# Altium project EP4_ECD_On_Board_Comptuer.PrjPcb (part 2 of 2)

## Sheet IR.SchDoc
size Letter; SheetNumber: 10; SheetTotal: 11
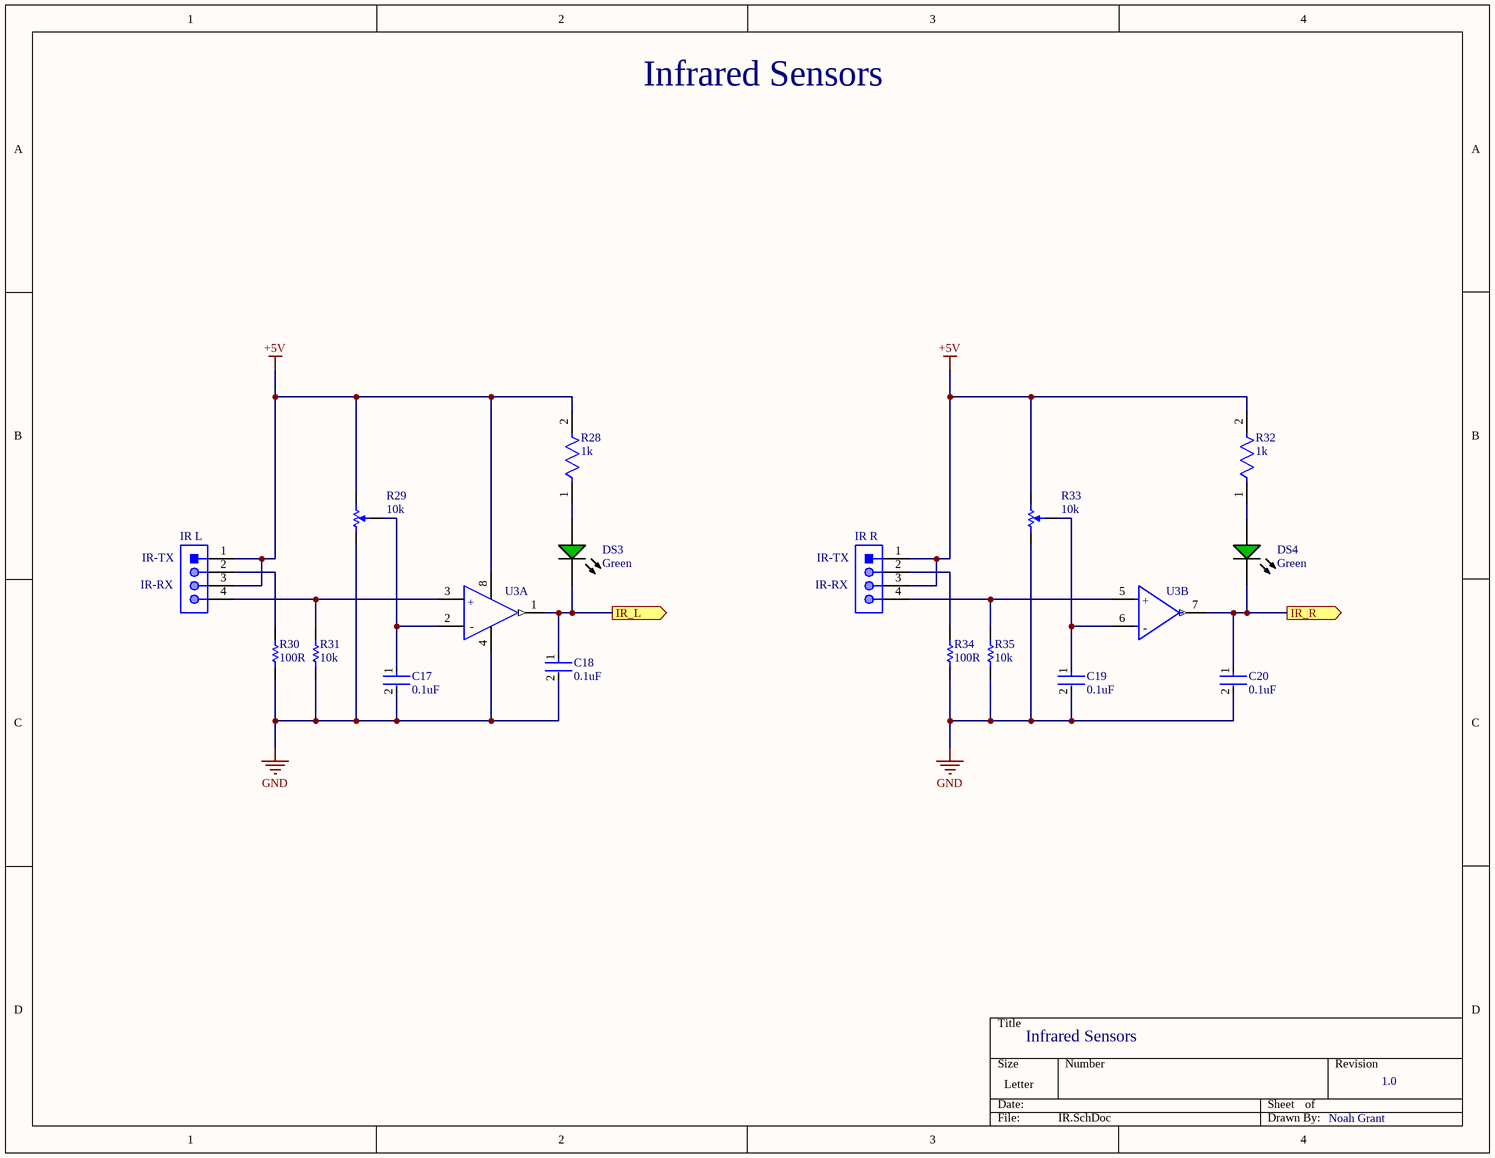
[diagram p6: IR.SchDoc]

### Parts
C17  0.1uF  [FP-CGA3E-0_3-0_1-IPC_A]
C18  0.1uF  [FP-CGA3E-0_3-0_1-IPC_A]
C19  0.1uF  [FP-CGA3E-0_3-0_1-IPC_A]
C20  0.1uF  [FP-CGA3E-0_3-0_1-IPC_A]
DS3  Green  [AVAG-HSMX-C190_V]
DS4  Green  [AVAG-HSMX-C190_V]
IR_L  61300411021  [61300411021]  (value not drawn)
IR_R  61300411021  [61300411021]  (value not drawn)
R28  1k  [FP-CRCW0603-e3-MFG]
R29  10k  [BOUR-TC33X-2_V]
R30  100R  [RESC1609X50X30ML8T20]
R31  10k  [RESC1609X50X30NL8T20]
R32  1k  [FP-CRCW0603-e3-MFG]
R33  10k  [BOUR-TC33X-2_V]
R34  100R  [RESC1609X50X30ML8T20]
R35  10k  [RESC1609X50X30NL8T20]
U3  LM393D  [FP-SO8-MFG]  (value not drawn)  (parts A,B of 2)

### Ports
IR_L (out, see Top_Sheet[4A], Nucleo[2B]), IR_R (out, see Top_Sheet[4A], Nucleo[1C])

### Nets
+5V: IR_L.1 IR_L.3 IR_R.1 IR_R.3 R28.2 R29.3 R32.2 R33.3 U3.8(Vcc+)
GND: C17.2 C18.2 C19.2 C20.2 R29.1 R30.1 R31.1 R33.1 R34.1 R35.1 U3.4(Vcc-)
IR_L: C18.1 DS3.2(K) U3.1(Out1) ; port IR_L
IR_R: C20.1 DS4.2(K) U3.7(Out2) ; port IR_R
NetC17_1: C17.1 R29.2 U3.2(In1-)
NetC19_1: C19.1 R33.2 U3.6(In2-)
NetDS3_1: DS3.1(A) R28.1
NetDS4_1: DS4.1(A) R32.1
NetIR_L_2: IR_L.2 R30.2
NetIR_L_4: IR_L.4 R31.2 U3.3(In1+)
NetIR_R_2: IR_R.2 R34.2
NetIR_R_4: IR_R.4 R35.2 U3.5(In2+)

### Notes on the sheet
- Infrared Sensors
- (near IR_L) IR-TX
- (near IR_R) IR-TX
- (near IR_L) IR-RX
- (near IR_R) IR-RX
- 1.0
- Noah Grant
- (in symbol CMP-12132-000003-1, part A) +; -
- (in symbol CMP-12132-000003-1, part B) +; -

### Library data of the parts
C17-C20 = CMP-2000-07546-2: Cap Ceramic 100nF 50V X7R 10% Pad SMD 0603 +125°C Automotive T/R; Weight: 7.1E-05oz; Composition: Ceramic; Max Operating Temperature: 125°C; Termination: SMD/SMT; Dielectric: X7R; Length: 1.6mm; Package Quantity: 1; REACH SVHC: No SVHC; Lead Free: Lead Free; Case Code (Metric): 1608; Min Operating Temperature: -55°C; Packaging: Tape and Reel; Tolerance: 10%; Voltage Rating: 50V; Case Code (Imperial): 0603; Capacitance: 100nF; Case/Package: 0603; Voltage Rating (DC): 50V; Depth: 0.8mm; Radiation Hardening: No; Ratings: AEC-Q200; Mount: Surface Mount; Voltage: 50V; Thickness: 0.035inch; Width: 0.8mm; Height: 0.8mm
DS3 DS4 = CMP-1744-00002-1: Chip LED, Green, 2.2 V, -40 to 85 degC, 2-Pin SMD, RoHS, Tape and Reel; Frequency: 400 KHz; Max Supply Voltage: 5.5 V; Access Time: 3500 ns; Clock Frequency: 100 KHz; Case\Package: SOIC; Density: 32 kb; Nominal Supply Current: 2 mA; Interface: Serial; Min Supply Voltage: 1.7 V; Packaging: Tape and Reel; PackageReference: HSMX-C190; ComponentLink2URL: http://docs.avagotech.com/docs/AV02-0551EN; RoHSCompliant: true; Pins: 8; REACH SVHC: No SVHC; Max Operating Temperature: 85 degC; Width: 4 mm; Radiation Hardening: No; Package Quantity: 3000; ComponentLink3Description: Package Specification; ComponentLink1Description: Manufacturer URL; Min Operating Temperature: -40 degC; PackageDescription: 2-Pin Surface Mount Device, Body 1.6 x 0.8 mm, Height 0.9 mm; Max Clock Frequency: 100 KHz; Height: 1.5 mm; ComponentLink1URL: http://www.avagotech.com/; DatasheetVersion: Mar-12; ComponentLink2Description: Datasheet; Mount: Surface Mount; Length: 5 mm; ComponentLink3URL: http://www.fairchildsemi.com/dwg/MA/MA03D.pdf
IR_L IR_R = CMP-1502-01063-1: THT Angled Pin Header WR-PHD, Pitch 2.54 mm, Single Row, 4 pins; Manufacturer: Wurth Elektronik; Gender: Male; Pin Number: 4; Withstanding Voltage: 500VAC; Working Voltage: 250VAC; Contact Resistance: 20mOhm; Pitch: 2.54mm; Rated Current: 3A; Manufacturer URL: http://www.we-online.de; Mounting Technology: THT; Publisher: WurthElektronik; Operating Temperature: -40to105degC; Packaging: Bag; Row Number: Single; Package Reference: 61300411021; Part Number: 61300411021; Orientation: Angled; Datasheet URL: https://katalog.we-online.de/em/datasheet/6130xx11021.pdf
R28 R32 = CMP-1666-00003-5: RES Thick Film, 1kΩ, 1%, 0.1W, 100ppm/°C, 0603; Max Power Dissipation: 100mW; Voltage Rating: 75V; Resistance: 1kR; Max Operating Temperature: 155°C; Number of Pins: 2; Case Code (Imperial): 0603; Width: 0.033inch; Power Rating: 100mW; Number of Terminations: 2; Package Quantity: 10; Weight: 7.1E-05oz; Tolerance: 1%; Temperature Coefficient: 100ppm/°C; Military Standard: Not; Mount: Surface Mount; Voltage Rating (DC): 75V; Depth: 0.85mm; Composition: Thick Film; Radiation Hardening: No; Termination: SMD/SMT; Length: 1.55mm; Case Code (Metric): 1608; Contact Plating: Tin; Min Operating Temperature: -55°C; Packaging: Tape and Reel; Height: 0.45mm; Lead Free: Lead Free; Case/Package: 0603; Features: Automotive AEC-Q200
R29 R33 = CMP-2100-03695-1: Trimming Potentiometer, 10000 Ohm, -40 to 100 degC, 3-Pin SMD, RoHS, Tape and Reel; Manufacturer: Bourns; Tolerance: 25%; Max Power Dissipation: 100mW; Number of Turns: 1; Resistance: 10KOhm; Temperature Coefficient: 250ppm/degreesC; Voltage Rating (DC): 50V; Datasheet URL: http://www.bourns.com/docs/Product-Datasheets/TC33.pdf; Composition: Potentiometer; Package Description: 3-Pin Surface Mount Device, Body 3.8 x 3.6 mm; Weight: 29.4mg; Power Rating: 100mW; Termination: FootPrint; Manufacturer URL: http://www.bourns.com/; Width: 0.118inch; Height: 0.047inch; Military Standard: Not; Radiation Hardening: No; Colour: Silver; Case/Package: SMD/SMT; Depth: 3.8mm; Min Operating Temperature: -40degC; Lead Free: LeadFree; Datasheet Version: 42583.0; REACH SVHC: NoSVHC; Length: 3mm; RoHSCompliant: true; Contact Plating: Silver; Taper: Linear; Packaging: TapeandReel; Mount: SurfaceMount; Max Operating Temperature: 100degC; Package Reference: TC33X-2; Package Quantity: 2500
R30 R34 = CMP-2000-03824-5: Chip Resistor, 100 Ohm, +/- 1%, 100 mW,-55 to 155 degC, 0603 (1608 Metric), RoHS, Tape and Ree; Manufacturer: Vishay Semiconductor; ComponentLink2URL: http://www.vishay.com/docs/20035/dcrcwe3.pdf; ComponentLink1URL: http://www.vishay.com/; Mounting Technology: Surface Mount; ComponentLink1Description: Manufacturer URL; ComponentLink2Description: Datasheet; PackageDescription: 2-Pin Surface Mount Device, Body 1.575 x 0.85 mm; PackageReference: 0603; DatasheetVersion: 06/2012
R31 R35 = CMP-1666-00005-4: Chip Resistor, 10 KOhm, +/- 1%, 100 mW, -55 to 155 degC, 0603 (1608 Metric), RoHS, Tape and Reel; Manufacturer: Vishay Semiconductor; Voltage Rating: 75 V; Max Operating Temperature: 155 degC; PackageDescription: 2-Pin Surface Mount Device, Body 1.575 x 0.85 mm; ComponentLink1Description: Manufacturer URL; RoHSCompliant: true; PackageReference: 0603; REACH SVHC: Unknown; Length: 1.55 mm; DatasheetVersion: 06/2012; Packaging: Tape and Reel; Min Operating Temperature: -55 degC; Mounting Technology: Surface Mount; ComponentLink2URL: https://datasheet.ciiva.com/11809/0900766b80d98afc-11809037.pdf; Height: 0.45 mm; ComponentLink2Description: Datasheet; Package Quantity: 5000; ComponentLink1URL: http://www.vishay.com/
U3 = CMP-12132-000003-1: IC VOLT COMPARATOR DUAL LP 8SOIC; Manufacturer: STMicroelectronics; Response Time: 1.3us; Min Supply Voltage: 2V; Input Offset Voltage: 1mV; Input Bias Current: 0.02uA; Max Dual Supply Voltage: 18V; Output Current Per Channel: 18mA; Max Junction Temp: +150°C; Standoff Height: 0.1mm; Number Of Channels: 2; Nominal Supply Current: 0.45-0.6mA; Voltage Gain: 200V/mV; Max Supply Voltage: 36V; Min Dual Supply Voltage: 1V; Ambient Temperature Range Low: 0°C; ComponentLink2Description: Datasheet; Lead Free: Yes; Device Class L3: Comparators; Device Class L2: Linear ICs; Manufacturer Part Number: LM393D; Digikey Description: IC VOLT COMPARATOR DUAL LP 8SOIC; Category: IC; Octopart: https://octopart.com/lm393d-stmicroelectronics-25832; Package: SO8; RoHS: TRUE; Footprint Url: https://www.st.com/resource/en/datasheet/stm8l001j3.pdf; Temperature Range Low: 0°C; Temperature Range High: +70°C; Mouser Description: Analog Comparators Lo-Pwr Dual Voltage; ComponentLink2URL: https://www.st.com/resource/en/datasheet/lm393.pdf; Automotive: No; Temperature: 0°C to +70°C; Height: 1.75mm; Device Class L1: Integrated Circuits (ICs); Ambient Temperature Range High: +70°C

## Sheet LCD_ULTRA.SchDoc
size Letter; SheetNumber: 8; SheetTotal: 11
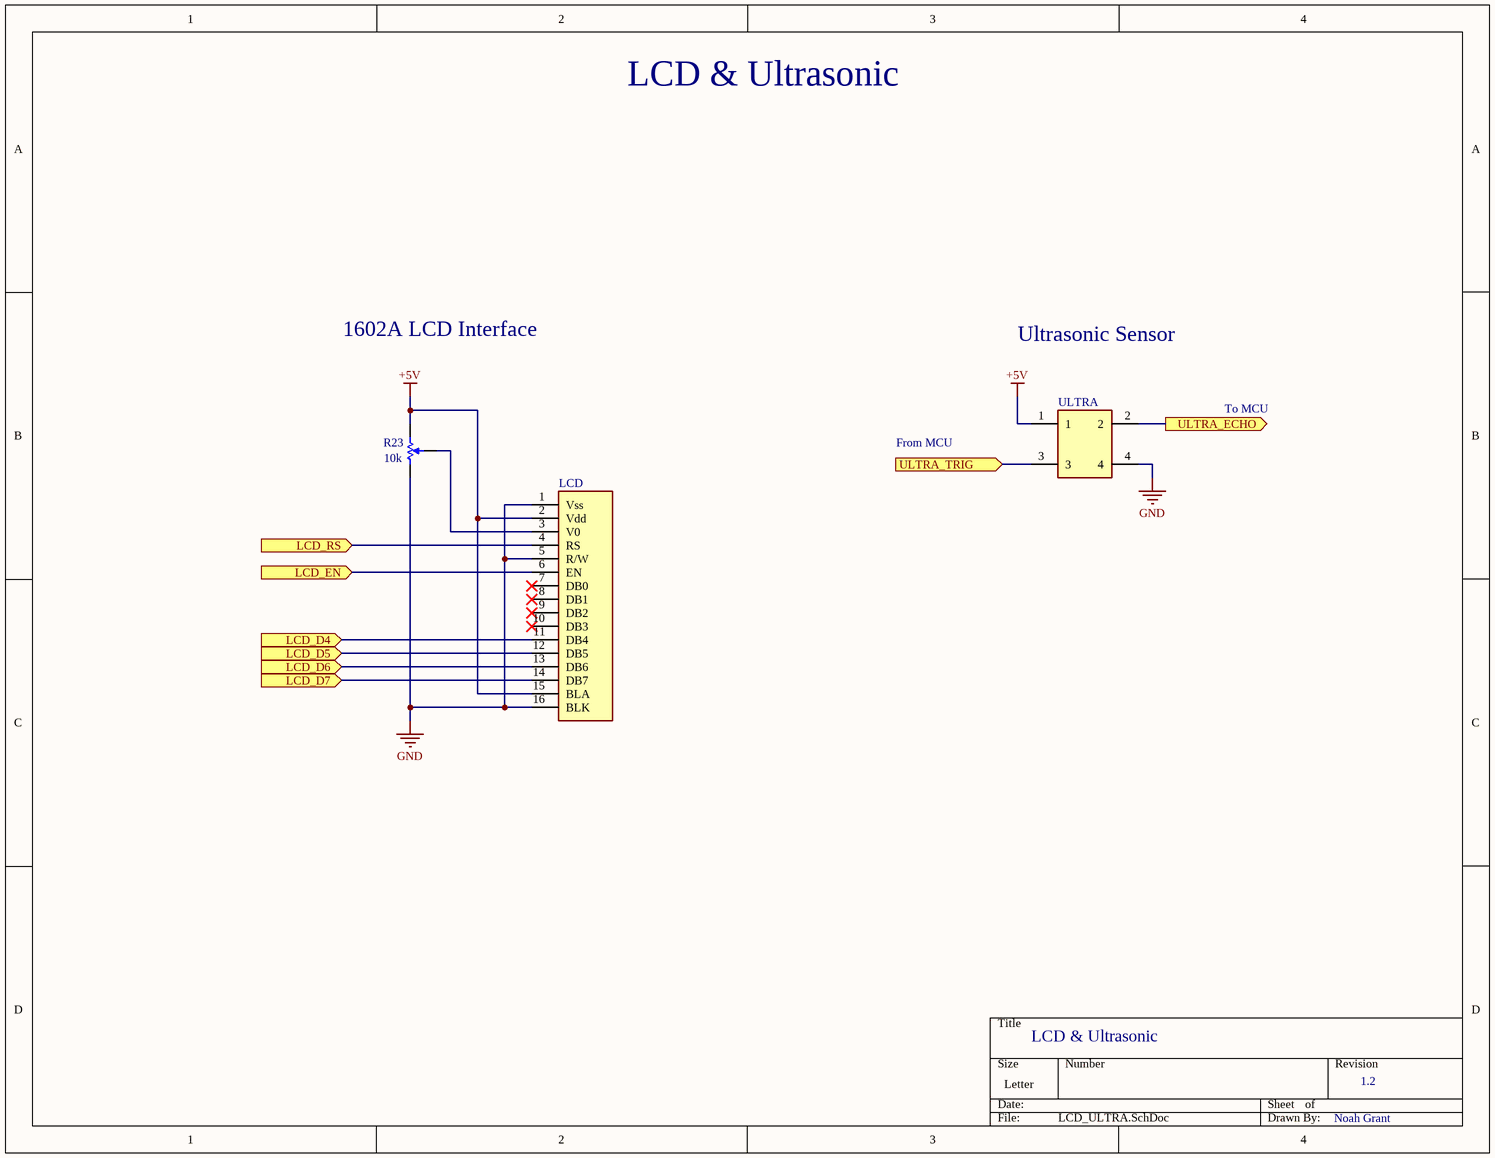
[diagram p7: LCD_ULTRA.SchDoc]

### Parts
LCD  PPPC161LFBN-RC  [RHDR16W80P0X254_1X16_4114X254X850P]  (value not drawn)
R23  10k  [BOUR-TC33X-2_V]
ULTRA  22-28-4043  [HDRV4W87P0X254_1X4_1016X249X863P]  (value not drawn)

### Ports
LCD_D4 (in, see Top_Sheet[4C], Nucleo[3C]), LCD_D5 (in, see Top_Sheet[4C], Nucleo[3C]), LCD_D6 (in, see Top_Sheet[4C], Nucleo[3C]), LCD_D7 (in, see Top_Sheet[4C], Nucleo[4C]), LCD_EN (in, see Top_Sheet[4C], Nucleo[3C]), LCD_RS (in, see Top_Sheet[4C], Nucleo[3C]), ULTRA_ECHO (out, see Top_Sheet[4C], Nucleo[3C]), ULTRA_TRIG (in, see Top_Sheet[4C], Nucleo[4C])

### Nets
+5V: LCD.2(Vdd) LCD.15(BLA) R23.3 ULTRA.1
GND: LCD.1(Vss) LCD.5(R/W) LCD.16(BLK) R23.1 ULTRA.4
LCD_D4: LCD.11(DB4) ; port LCD_D4
LCD_D5: LCD.12(DB5) ; port LCD_D5
LCD_D6: LCD.13(DB6) ; port LCD_D6
LCD_D7: LCD.14(DB7) ; port LCD_D7
LCD_EN: LCD.6(EN) ; port LCD_EN
LCD_RS: LCD.4(RS) ; port LCD_RS
ULTRA_ECHO: ULTRA.2 ; port ULTRA_ECHO
ULTRA_TRIG: ULTRA.3 ; port ULTRA_TRIG
NetLCD_3: LCD.3(V0) R23.2

Not connected (* = marked no-connect by the designer): LCD 7(DB0)* 8(DB1)* 9(DB2)* 10(DB3)*

### Notes on the sheet
- LCD & Ultrasonic
- 1602A LCD Interface
- Ultrasonic Sensor
- To MCU
- From MCU
- 1.2
- Noah Grant

### Library data of the parts
LCD = PPPC161LFBN-RC: Connector; Manufacturer_Name: Sullins; Datasheet Link: https://drawings-pdf.s3.amazonaws.com/10492.pdf; Height: 8.5mm; Manufacturer_Part_Number: PPPC161LFBN-RC
R23 = CMP-2100-03695-1: as R29 on sheet IR; Datasheet URL: http://www.bourns.com/docs/Product-Datasheets/TC33.pdf; Composition: Potentiometer; Package Description: 3-Pin Surface Mount Device, Body 3.8 x 3.6 mm; Weight: 29.4mg; Power Rating: 100mW; Termination: FootPrint; Manufacturer URL: http://www.bourns.com/; Width: 0.118inch; Height: 0.047inch; Military Standard: Not; Radiation Hardening: No; Colour: Silver; Case/Package: SMD/SMT; Depth: 3.8mm; Min Operating Temperature: -40degC; Lead Free: LeadFree; Datasheet Version: 42583.0; REACH SVHC: NoSVHC; Length: 3mm; RoHSCompliant: true; Contact Plating: Silver; Taper: Linear; Packaging: TapeandReel; Mount: SurfaceMount; Max Operating Temperature: 100degC; Package Reference: TC33X-2; Package Quantity: 2500
ULTRA = 22-28-4043: Connector; Manufacturer_Name: Molex; Datasheet Link: http://www.molex.com/molex/products/datasheet.jsp?part=active/0022284023_PCB_HEADERS.xml; Height: 8.63mm; Manufacturer_Part_Number: 22-28-4043; Mouser Part Number: 538-22-28-4043; Mouser Price/Stock: https://www.mouser.co.uk/ProductDetail/Molex/22-28-4043?qs=MuwpYaHj751%252Bm8qLwZDsXA%3D%3D

## Sheet Debug.SchDoc
size Letter; SheetNumber: 11; SheetTotal: 11
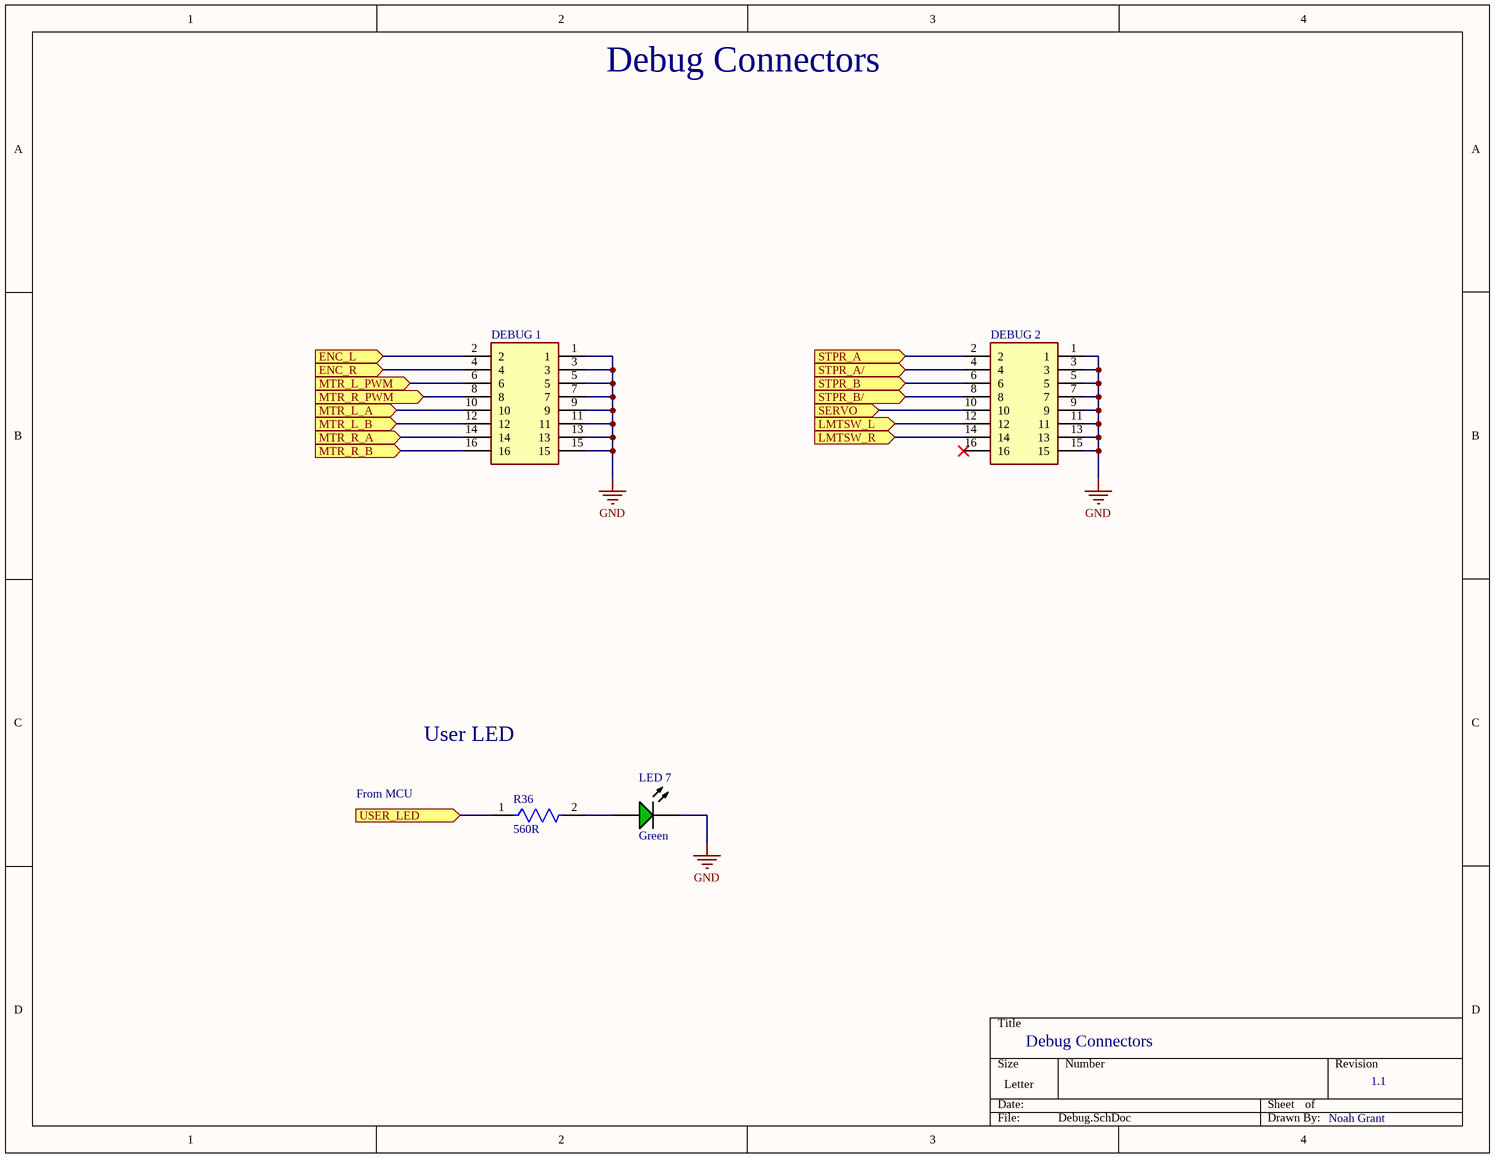
[diagram p8: Debug.SchDoc]

### Parts
DEBUG_1  3020-16-0300-00  [302016030000]  (value not drawn)
DEBUG_2  3020-16-0300-00  [302016030000]  (value not drawn)
LED_7  Green  [AVAG-HSMX-C190_V]
R36  560R  [FP-CPF0603-MFG]

### Ports
ENC_L (in, see Top_Sheet[2D], DCMTR_ENC[2B], Nucleo[2C]), ENC_R (in, see Top_Sheet[2D], DCMTR_ENC[1A], Nucleo[2C]), LMTSW_L (in, see Top_Sheet[2D], Nucleo[4B], STPR_LMTSW_SRV[2C]), LMTSW_R (in, see Top_Sheet[3D], Nucleo[4B], STPR_LMTSW_SRV[2D]), MTR_L_A (in, see Top_Sheet[2D], DCMTR_ENC[3C], Nucleo[1B]), MTR_L_B (in, see Top_Sheet[2D], DCMTR_ENC[3C], Nucleo[1C]), MTR_L_PWM (in, see Top_Sheet[2D], DCMTR_ENC[3C], Nucleo[1B]), MTR_R_A (in, see Top_Sheet[2D], DCMTR_ENC[3C], Nucleo[4B]), MTR_R_B (in, see Top_Sheet[2D], DCMTR_ENC[3C], Nucleo[3B]), MTR_R_PWM (in, see Top_Sheet[2D], DCMTR_ENC[3C], Nucleo[2B]), SERVO (in, see Top_Sheet[3D], Nucleo[4C], STPR_LMTSW_SRV[3C]), STPR_A (in, see Top_Sheet[3D], Nucleo[2C], STPR_LMTSW_SRV[1B]), STPR_A/ (in, see Top_Sheet[3D], Nucleo[2C], STPR_LMTSW_SRV[1B]), STPR_B (in, see Top_Sheet[3D], Nucleo[1C], STPR_LMTSW_SRV[1B]), STPR_B/ (in, see Top_Sheet[3D], Nucleo[1C], STPR_LMTSW_SRV[1B]), USER_LED (in, see Top_Sheet[3D], Nucleo[1C])

### Nets
GND: DEBUG_1.1 DEBUG_1.3 DEBUG_1.5 DEBUG_1.7 DEBUG_1.9 DEBUG_1.11 DEBUG_1.13 DEBUG_1.15 DEBUG_2.1 DEBUG_2.3 DEBUG_2.5 DEBUG_2.7 DEBUG_2.9 DEBUG_2.11 DEBUG_2.13 DEBUG_2.15 LED_7.2(K)
ENC_L: DEBUG_1.2 ; port ENC_L
ENC_R: DEBUG_1.4 ; port ENC_R
LMTSW_L: DEBUG_2.12 ; port LMTSW_L
LMTSW_R: DEBUG_2.14 ; port LMTSW_R
MTR_L_A: DEBUG_1.10 ; port MTR_L_A
MTR_L_B: DEBUG_1.12 ; port MTR_L_B
MTR_L_PWM: DEBUG_1.6 ; port MTR_L_PWM
MTR_R_A: DEBUG_1.14 ; port MTR_R_A
MTR_R_B: DEBUG_1.16 ; port MTR_R_B
MTR_R_PWM: DEBUG_1.8 ; port MTR_R_PWM
SERVO: DEBUG_2.10 ; port SERVO
STPR_A: DEBUG_2.2 ; port STPR_A
STPR_A/: DEBUG_2.4 ; port STPR_A/
STPR_B: DEBUG_2.6 ; port STPR_B
STPR_B/: DEBUG_2.8 ; port STPR_B/
USER_LED: R36.1 ; port USER_LED
NetLED_7_1: LED_7.1(A) R36.2

Not connected (* = marked no-connect by the designer): DEBUG_2 16*

### Notes on the sheet
- Debug Connectors
- User LED
- From MCU
- 1.1
- Noah Grant

### Library data of the parts
DEBUG_1 DEBUG_2 = 3020-16-0300-00: Connector; Manufacturer_Name: CNC Tech; Datasheet Link: http://cnctech.us/pdfs/3020-XX-0300-00.pdf; Height: 9.95mm; Manufacturer_Part_Number: 3020-16-0300-00; Arrow Part Number: 3020-16-0300-00; Arrow Price/Stock: https://www.arrow.com/en/products/3020-16-0300-00/cnc-tech-llc?region=nac
LED_7 = CMP-1744-00002-1: as DS3 on sheet IR; Packaging: Tape and Reel; PackageReference: HSMX-C190; ComponentLink2URL: http://docs.avagotech.com/docs/AV02-0551EN; RoHSCompliant: true; Pins: 8; REACH SVHC: No SVHC; Max Operating Temperature: 85 degC; Width: 4 mm; Radiation Hardening: No; Package Quantity: 3000; ComponentLink3Description: Package Specification; ComponentLink1Description: Manufacturer URL; Min Operating Temperature: -40 degC; PackageDescription: 2-Pin Surface Mount Device, Body 1.6 x 0.8 mm, Height 0.9 mm; Max Clock Frequency: 100 KHz; Height: 1.5 mm; ComponentLink1URL: http://www.avagotech.com/; DatasheetVersion: Mar-12; ComponentLink2Description: Datasheet; Mount: Surface Mount; Length: 5 mm; ComponentLink3URL: http://www.fairchildsemi.com/dwg/MA/MA03D.pdf
R36 = CMP-03211-007342-1: RES SMD 560Ω 0.1% 1/16W 0603; Manufacturer Part Number: CPF0603B560RE1; Manufacturer: TE Connectivity; Temperature Coefficient: 25ppm/°C; Voltage Rating: 50V; Power Rating: 0.063W; Lead Free: Yes; Automotive: No; Octopart: https://octopart.com/cpf0603b560re1-te+connectivity-9539416; Temperature Range High: +155°C; Device Class L2: Resistors; Temperature Range Low: -55°C; Composition: Thin Film; RoHS: TRUE; ComponentLink2URL: https://www.te.com/commerce/DocumentDelivery/DDEController?Action=showdoc&DocId=Data+Sheet%7F1773200%7FM%7Fpdf%7FEnglish%7FENG_DS_1773200_M.pdf%7F3-1676481-2; Temperature: -55°C to +155°C; Device Class L1: Passive Components; Resistance: 560Ω; Height: 0.55mm; Series: CPF; octopart_url: https://octopart.com/cpf0603b560re1-te+connectivity-9539416; Category: Res; Tolerance: 0.1%; ComponentLink2Description: Datasheet; packaging: 1k Reel; Package: CPF0603; Device Class L3: Chip SMD Resistors; Value: 560Ω; Ipc Land Pattern Name: RESC15580X45

## Sheet PC104_Connectors.SchDoc
size Letter; SheetNumber: 2; SheetTotal: 11
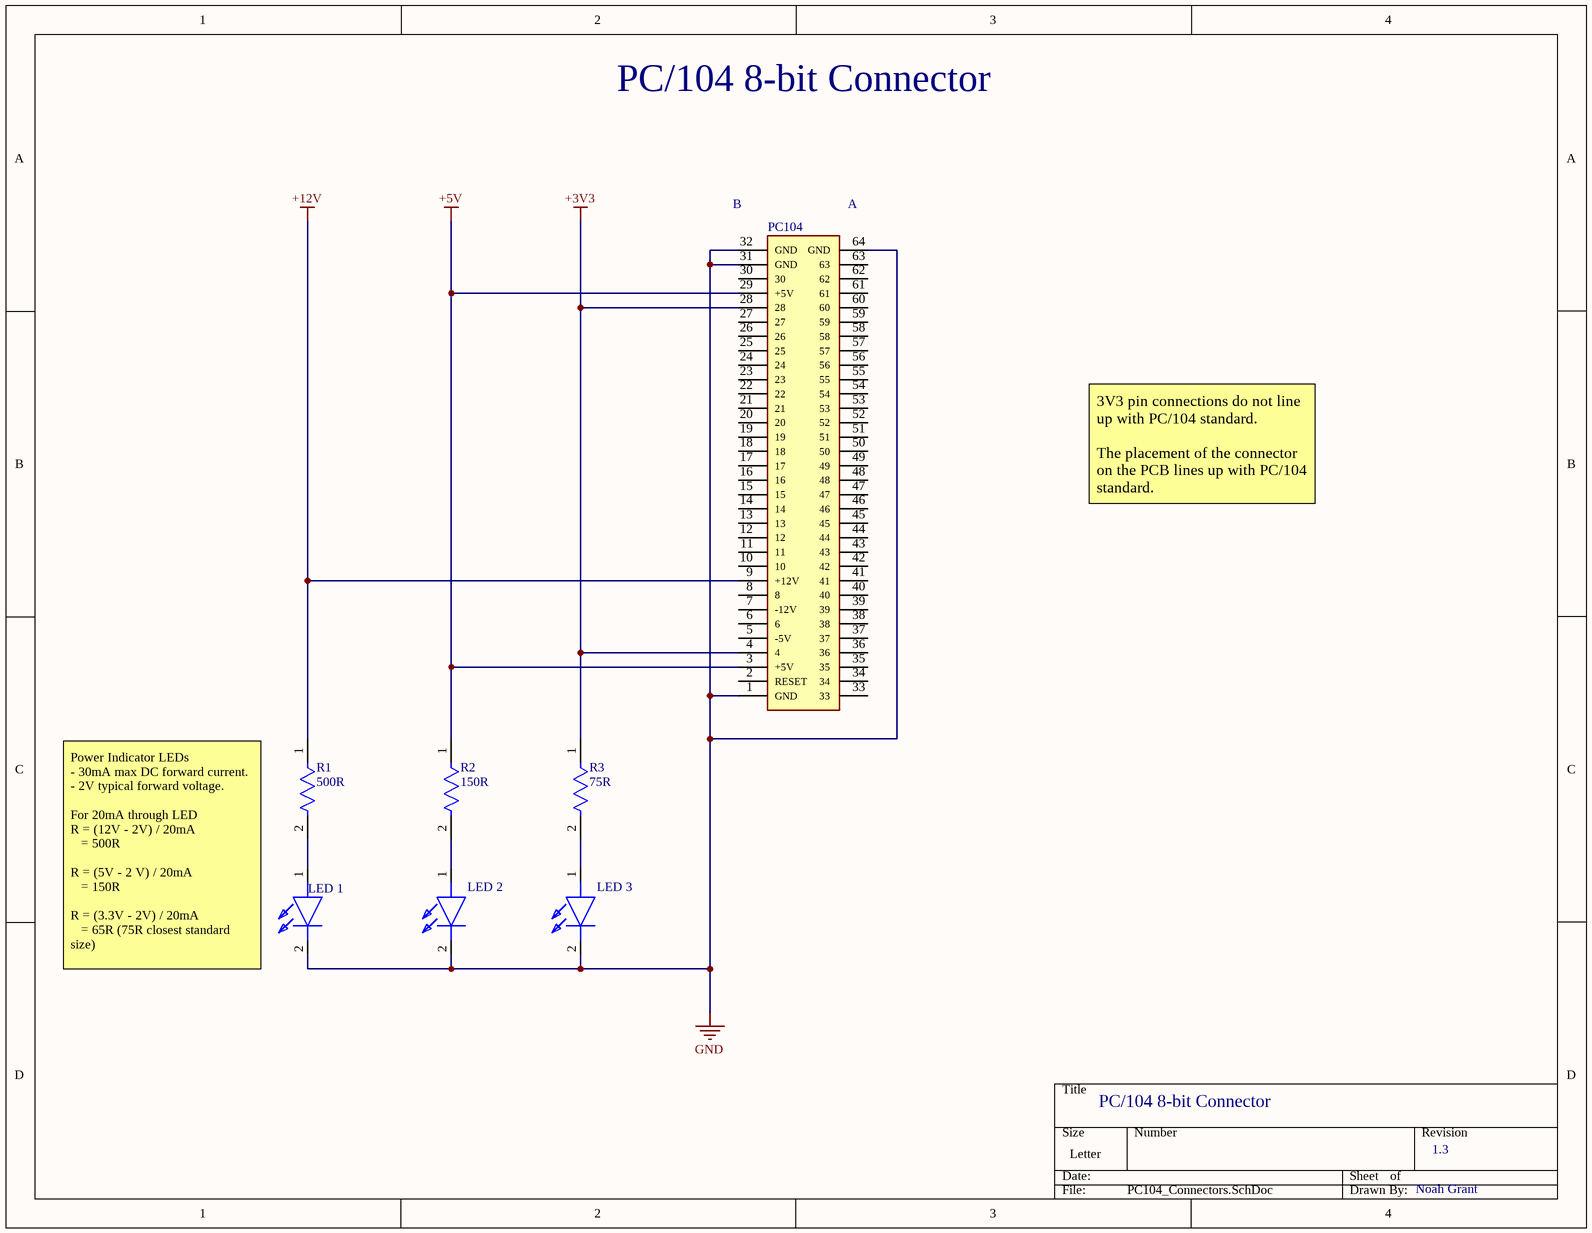
[diagram p9: PC104_Connectors.SchDoc]

### Parts
LED_1  APL3015EC-F01  [APL3015ECF01]  (value not drawn)
LED_2  APL3015EC-F01  [APL3015ECF01]  (value not drawn)
LED_3  APL3015EC-F01  [APL3015ECF01]  (value not drawn)
PC104  10153302-32111LF  [RHDR64W74P254_2X32_8238X499X1115P]  (value not drawn)
R1  500R  [FP-TFCR0603-IPC_A]
R2  150R  [FP-MCT0603-IPC_C]
R3  75R  [FP-RT0603-MFG]

### Nets
+3V3: PC104.4 PC104.28 R3.1
+5V: PC104.3(+5V) PC104.29(+5V) R2.1
+12V: PC104.9(+12V) R1.1
GND: LED_1.2(K) LED_2.2(K) LED_3.2(K) PC104.1(GND) PC104.31(GND) PC104.32(GND) PC104.64(GND)
NetLED_1_1: LED_1.1(A) R1.2
NetLED_2_1: LED_2.1(A) R2.2
NetLED_3_1: LED_3.1(A) R3.2

Not connected (* = marked no-connect by the designer): PC104 2(RESET) 5(-5V) 6 7(-12V) 8 10 11 12 13 14 15 16 17 18 19 20 21 22 23 24 25 26 27 30 33 34 35 36 37 38 39 40 41 42 43 44 45 46 47 48 49 50 51 52 53 54 55 56 57 58 59 60 61 62 63

### Notes on the sheet
- PC/104 8-bit Connector
- (near PC104) B
- (near PC104) A
- 3V3 pin connections do not line up with PC/104 standard.
  The placement of the connector on the PCB lines up with PC/104 standard.
- Power Indicator LEDs
  - 30mA max DC forward current.
  - 2V typical forward voltage.
  For 20mA through LED
  R = (12V - 2V) / 20mA
  = 500R
  R = (5V - 2 V) / 20mA
  = 150R
  R = (3.3V - 2V) / 20mA
  = 65R (75R closest standard size)
- 1.3
- Noah Grant

### Library data of the parts
LED_1-LED_3 = APL3015EC-F01: LED; Manufacturer_Name: Kingbright; Datasheet Link: https://componentsearchengine.com/Datasheets/1/APL3015EC-F01.pdf; Manufacturer_Part_Number: APL3015EC-F01; Mouser Part Number: 604-APL3015EC-F01; Mouser Price/Stock: https://www.mouser.co.uk/ProductDetail/Kingbright/APL3015EC-F01?qs=VdjlWU%2FzoOF91deOgS6C3g%3D%3D
PC104 = 10153302-32111LF: Connector; Manufacturer_Name: Amphenol Communication Solutions; Datasheet Link: https://cdn.amphenol-cs.com/media/wysiwyg/files/drawing/10153302.pdf; Height: 11.15mm; Manufacturer_Part_Number: 10153302-32111LF
R1 = CMP-250906-063952-1: RES Thin Film,  500Ω, 0.1%, 0.1W, 25ppm/°C, 0603; RoHS Compliant: Yes
R2 = CMP-02407-011712-1: RES SMD 150 OHM 1% 1/8W 0603; Power Rating: 125mW; Tolerance: 0.5%; Voltage Rating: 75V; Max Power Dissipation: 150mW; Temperature Coefficient: 25ppm/°C; Resistance: 150R; Packaging: Tape and Reel; Termination: SMD/SMT; Construction: Rectangular; Max Operating Temperature: 175°C; Length: 0.061inch; Case/Package: 0603; Depth: 0.85mm; Military Standard: Not; Case Code (Metric): 1608; Package Quantity: 1; Width: 0.8mm; Features: Automotive AEC-Q200; Height: 0.022inch; REACH SVHC: No SVHC; Min Operating Temperature: -55°C; Resistor Type: Thin Film; RoHS Compliant: Yes; Resistance Tolerance: 0.5%; Series: MCT 0603 - Professional; Voltage Rating (DC): 75V; Number of Terminations: 2; Case Code (Imperial): 0603; Number of Pins: 2
R3 = CMP-2000-04797-2: RES SMD 75 OHM 1% 1/10W 0603; Manufacturer: Yageo; Manufacturer Part Number: RT0603FRE0775RL; Resistance: 75Ω; Voltage Rating: 75V; Tolerance: 0.01; Value: 75Ω; Power Rating: 0.1W; Temperature Coefficient: 50 ppm/°C; Ipc Land Pattern Name: RESC16080X45; Height: 0.55mm; Lead Free: Yes; Mouser Description: Res Thin Film 0603 75 Ohm 1% 1/10W ±50ppm/°C Molded SMD SMD Paper T/R; Device Class L2: Resistors; Device Class L1: Passive Components; Series: RT; Composition: Thin Film; Automotive: No; Footprint Url: http://www.yageo.com/exep/pages/download/literatures/PYu-R_Mount_10.pdf; Temperature: -55°C to +155°C; Temperature Range High: +155°C; Temperature Range Low: -55°C; ComponentLink2URL: http://www.yageo.com/documents/recent/PYu-RT_1-to-0.01_RoHS_L_9.pdf; Device Class L3: Chip SMD Resistors; Octopart: https://octopart.com/rt0603fre0775rl-yageo-1163751; ComponentLink2Description: Datasheet; RoHS: TRUE; Digikey Description: RES SMD 75 OHM 1% 1/10W 0603; Category: Res; Package: RT0603

## Sheet Keypad.SchDoc
size Letter; SheetNumber: 9; SheetTotal: 11
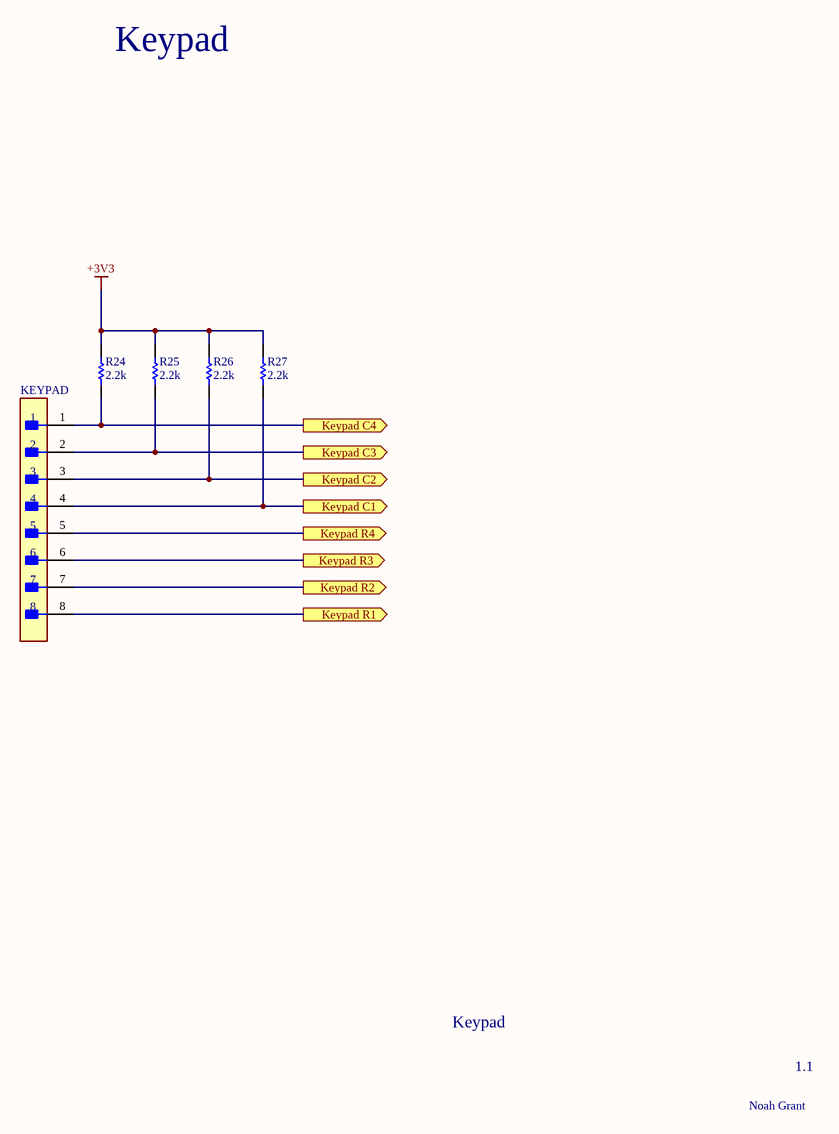
[diagram p10: Keypad.SchDoc]

### Parts
KEYPAD  TSW-108-08-G-S  [FP-TSW-108-08-G-S-MFG]  (value not drawn)
R24  2.2k  [RESC1609X50X30NL10T20]
R25  2.2k  [RESC1609X50X30NL10T20]
R26  2.2k  [RESC1609X50X30NL10T20]
R27  2.2k  [RESC1609X50X30NL10T20]

### Ports
Keypad C1 (out, see Top_Sheet[1C], Nucleo[3C]), Keypad C2 (out, see Top_Sheet[1C], Nucleo[3C]), Keypad C3 (out, see Top_Sheet[1C], Nucleo[3C]), Keypad C4 (out, see Top_Sheet[1C], Nucleo[1C]), Keypad R1 (out, see Top_Sheet[1C], Nucleo[2C]), Keypad R2 (out, see Top_Sheet[1C], Nucleo[4C]), Keypad R3 (out, see Top_Sheet[1C], Nucleo[4C]), Keypad R4 (out, see Top_Sheet[1C], Nucleo[3C])

### Nets
+3V3: R24.2 R25.2 R26.2 R27.2
Keypad C1: KEYPAD.4 R27.1 ; port Keypad C1
Keypad C2: KEYPAD.3 R26.1 ; port Keypad C2
Keypad C3: KEYPAD.2 R25.1 ; port Keypad C3
Keypad C4: KEYPAD.1 R24.1 ; port Keypad C4
Keypad R1: KEYPAD.8 ; port Keypad R1
Keypad R2: KEYPAD.7 ; port Keypad R2
Keypad R3: KEYPAD.6 ; port Keypad R3
Keypad R4: KEYPAD.5 ; port Keypad R4

### Notes on the sheet
- Keypad
- 1.1
- Noah Grant

### Library data of the parts
KEYPAD = CMP-02766-000001-1: CONN HEADER VERT 8POS 2.54MM; Manufacturer: Samtec; Number Of Contacts: 8; Conn Orientation: Straight; Conn Gender: Male; Device Class L1: Connectors; ComponentLink2Description: Datasheet; Digikey Description: CONN HEADER VERT 8POS 2.54MM; ComponentLink2URL: http://suddendocs.samtec.com/catalog_english/tsw_th.pdf; Temperature: -55°C to +125°C; RoHS: TRUE; Mouser Description: TSW - Samtec 2.54mm Pin Header 13.46mm Overall Pin Length 5.08mm Tail; Automotive: No; Temperature Range High: +125°C; Package: TSW-108-08-G-S; Device Class L3: unset; Manufacturer Part Number: TSW-108-08-G-S; Pitch: 2.54mm; Number Of Rows: 1; Lead Free: Yes; Height: 8.71mm; Contact Material: Gold,Nickel; Footprint Url: http://suddendocs.samtec.com/prints/tsw-xxx-xx-x-x-xx-xxx-footprint.pdf; Temperature Range Low: -55°C; Octopart: https://octopart.com/tsw-108-08-g-s-samtec-272653; Category: Conn; Device Class L2: Headers and Wire Housings
R24-R27 = CMP-2000-03167-1: 0603; Part Number: CRCW06032K20FKEA; Manufacturer: Vishay Dale

## Nets that join several sheets
+3V3: DCMTR_ENC (R5.2 R6.1 R7.2 R8.1), STPR_LMTSW_SRV (R10.2 R12.2), RS232 (C10.1 RS232_DRV.16), PC104_Connectors (PC104.4 PC104.28 R3.1), Keypad (R24.2 R25.2 R26.2 R27.2)
+5V: Nucleo (E5V.1), DCMTR_ENC (C1.1 C3.1 DC_MTR.20 U1.14), STPR_LMTSW_SRV (C6.1 P2.11 R9.2 STPR.20), CAN_DAC (5 pins), IR (9 pins), LCD_ULTRA (LCD.2 LCD.15 R23.3 ULTRA.1), PC104_Connectors (PC104.3 PC104.29 R2.1)
+12V: DCMTR_ENC (C2.1 DC_MTR.10), STPR_LMTSW_SRV (C7.1 STPR.10), PC104_Connectors (PC104.9 R1.1)
GND: Nucleo (8 pins), DCMTR_ENC (16 pins), STPR_LMTSW_SRV (15 pins), RS232 (11 pins), CAN_DAC (7 pins), IR (11 pins), LCD_ULTRA (5 pins), Debug (17 pins), PC104_Connectors (7 pins)
ANLG_REF_3V3: Nucleo (NUCLEO_CN10.7), CAN_DAC (P1.1 SCOPE.1)
CAN_RX: Nucleo (NUCLEO_CN10.3), CAN_DAC (CAN.4)
CAN_TX: Nucleo (NUCLEO_CN10.5), CAN_DAC (CAN.1)
DAC_CH1: Nucleo (NUCLEO_CN7.32), CAN_DAC (P1.5 SCOPE.3)
DAC_CH2: Nucleo (NUCLEO_CN10.11), CAN_DAC (P1.3 SCOPE.2)
ENC_L: Nucleo (NUCLEO_CN7.28), DCMTR_ENC (U1.8), Debug (DEBUG_1.2)
ENC_R: Nucleo (NUCLEO_CN7.30), DCMTR_ENC (U1.6), Debug (DEBUG_1.4)
IR_L: Nucleo (NUCLEO_CN7.4), IR (C18.1 DS3.2 U3.1)
IR_R: Nucleo (NUCLEO_CN7.31), IR (C20.1 DS4.2 U3.7)
Keypad C1: Nucleo (NUCLEO_CN10.27), Keypad (KEYPAD.4 R27.1)
Keypad C2: Nucleo (NUCLEO_CN10.29), Keypad (KEYPAD.3 R26.1)
Keypad C3: Nucleo (NUCLEO_CN10.17), Keypad (KEYPAD.2 R25.1)
Keypad C4: Nucleo (NUCLEO_CN7.21), Keypad (KEYPAD.1 R24.1)
Keypad R1: Nucleo (NUCLEO_CN7.34), Keypad (KEYPAD.8)
Keypad R2: Nucleo (NUCLEO_CN10.24), Keypad (KEYPAD.7)
Keypad R3: Nucleo (NUCLEO_CN10.22), Keypad (KEYPAD.6)
Keypad R4: Nucleo (NUCLEO_CN10.31), Keypad (KEYPAD.5)
LCD_D4: Nucleo (NUCLEO_CN10.23), LCD_ULTRA (LCD.11)
LCD_D5: Nucleo (NUCLEO_CN10.21), LCD_ULTRA (LCD.12)
LCD_D6: Nucleo (NUCLEO_CN10.33), LCD_ULTRA (LCD.13)
LCD_D7: Nucleo (NUCLEO_CN10.14), LCD_ULTRA (LCD.14)
LCD_EN: Nucleo (NUCLEO_CN10.15), LCD_ULTRA (LCD.6)
LCD_RS: Nucleo (NUCLEO_CN10.13), LCD_ULTRA (LCD.4)
LMTSW_L: Nucleo (NUCLEO_CN10.6), STPR_LMTSW_SRV (U1.2), Debug (DEBUG_2.12)
LMTSW_R: Nucleo (NUCLEO_CN10.4), STPR_LMTSW_SRV (U1.4), Debug (DEBUG_2.14)
MTR_L_A: Nucleo (NUCLEO_CN7.3), DCMTR_ENC (DC_MTR.2), Debug (DEBUG_1.10)
MTR_L_B: Nucleo (NUCLEO_CN7.23), DCMTR_ENC (DC_MTR.9), Debug (DEBUG_1.12)
MTR_L_PWM: Nucleo (NUCLEO_CN7.1), DCMTR_ENC (DC_MTR.1), Debug (DEBUG_1.6)
MTR_R_A: Nucleo (NUCLEO_CN10.2), DCMTR_ENC (DC_MTR.12), Debug (DEBUG_1.14)
MTR_R_B: Nucleo (NUCLEO_CN10.1), DCMTR_ENC (DC_MTR.19), Debug (DEBUG_1.16)
MTR_R_PWM: Nucleo (NUCLEO_CN7.2), DCMTR_ENC (DC_MTR.11), Debug (DEBUG_1.8)
SERVO: Nucleo (NUCLEO_CN10.26), STPR_LMTSW_SRV (R14.1), Debug (DEBUG_2.10)
STPR_A: Nucleo (NUCLEO_CN7.38), STPR_LMTSW_SRV (STPR.2), Debug (DEBUG_2.2)
STPR_A/: Nucleo (NUCLEO_CN7.36), STPR_LMTSW_SRV (STPR.9), Debug (DEBUG_2.4)
STPR_B: Nucleo (NUCLEO_CN7.35), STPR_LMTSW_SRV (STPR.12), Debug (DEBUG_2.6)
STPR_B/: Nucleo (NUCLEO_CN7.37), STPR_LMTSW_SRV (STPR.19), Debug (DEBUG_2.8)
UART_CTS: Nucleo (NUCLEO_CN10.28), RS232 (RS232_DRV.10)
UART_RTS: Nucleo (NUCLEO_CN10.30), RS232 (RS232_DRV.9)
UART_RX: Nucleo (NUCLEO_CN10.18), RS232 (RS232_DRV.12 U1.13)
UART_TX: Nucleo (NUCLEO_CN10.25), RS232 (RS232_DRV.11 U1.11)
ULTRA_ECHO: Nucleo (NUCLEO_CN10.19), LCD_ULTRA (ULTRA.2)
ULTRA_TRIG: Nucleo (NUCLEO_CN10.12), LCD_ULTRA (ULTRA.3)
USER_LED: Nucleo (NUCLEO_CN7.17), Debug (R36.1)